# Altium schematic sheet MAZ000158 - Diagrama físico.SchDoc: MAZ000158 - Diagrama físico
size A; ApprovedBy: Christian Ledwidth; CheckedBy: Nahuel Martinez; Author: Santiago Marti; CompanyName: Body Health; DrawnBy: Santiago Marti; Revision: A; SheetNumber: 2; SheetTotal: 2
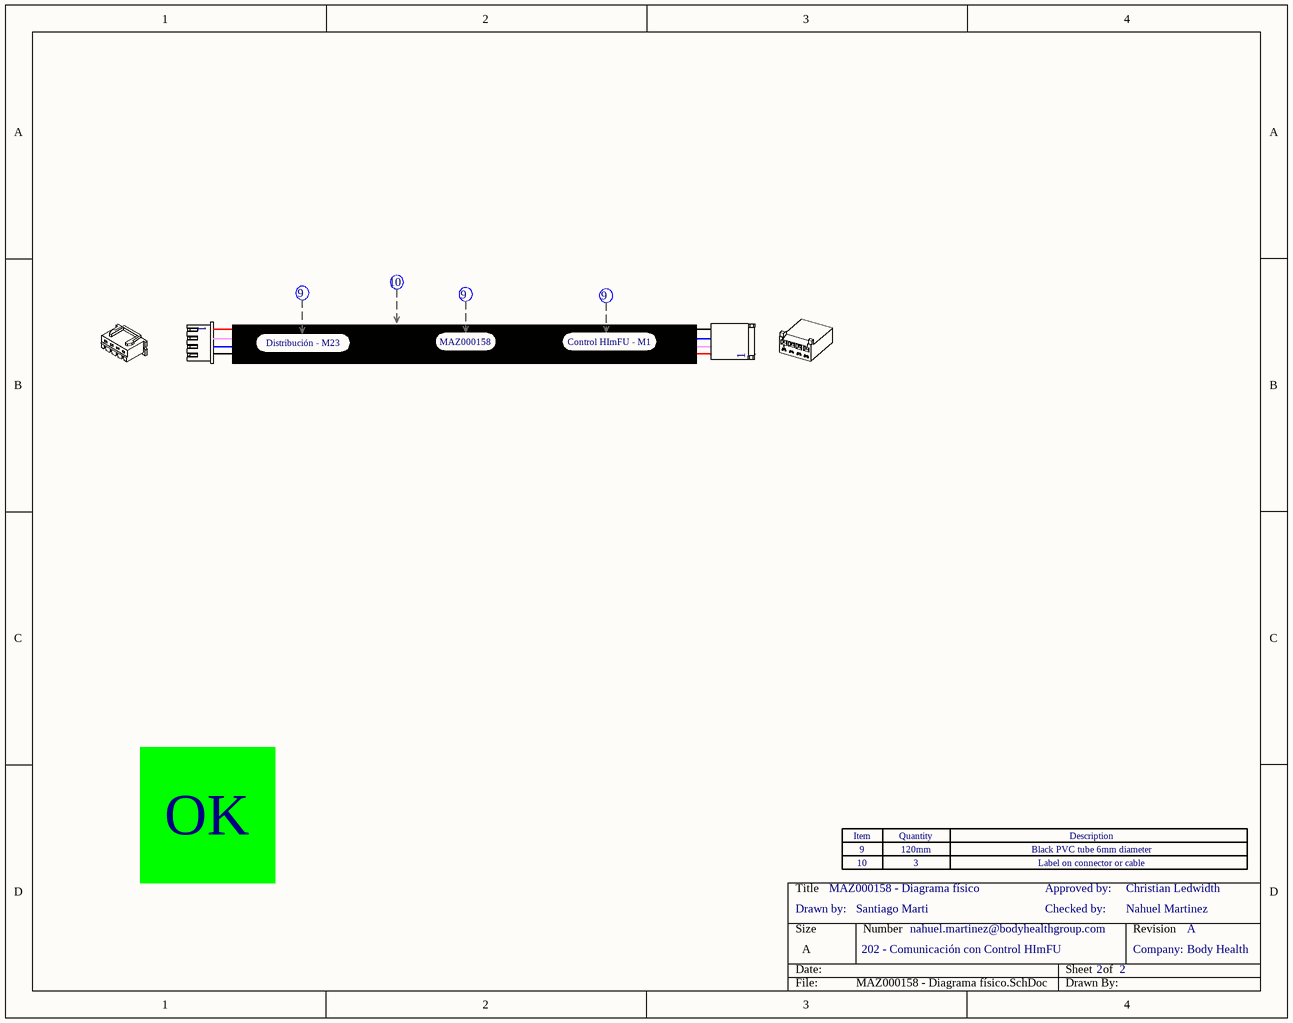
[diagram p0: MAZ000158 - Diagrama físico.SchDoc]

## Parts
Con1  XHP-4  (value not drawn)  (parts A,B of 4)
Con2  CST-100-4  (value not drawn)  (parts A,B of 4)
Eti1  Etiqueta  (value not drawn)
Eti2  Etiqueta  (value not drawn)
Eti3  Etiqueta  (value not drawn)
Ter1  Termocontraible  (value not drawn)
Zoc1  Zócalo_Header  (value not drawn)
Zoc10  Zócalo_Item  (value not drawn)
Zoc11  Zócalo_Item  (value not drawn)

## Notes on the sheet
- Distribución - M23
- (near Eti2) MAZ000158
- (near Eti3) Control HImFU - M1
- OK
- Drawn by:
- 10
- 9
- 3
- 120mm
- Checked by:
- Approved by:
- Label on connector or cable
- Black PVC tube 6mm diameter
- 202 - Comunicación con Control HImFU
- nahuel.martinez@bodyhealthgroup.com
- Company:
- (in symbol Zócalo_Header) Item; Quantity; Description

## Library data of the parts
Con1 = XHP-4: CONN HOUSING 2.5MM 4POS; Fabricante: JST Sales America Inc.; Cod.DigiKey: 455-2267-ND; Cod.Fabricante: XHP-4; ComponentLink1Description: Manufacturer Link; ComponentLink1URL: http://www.jst-mfg.com/product/pdf/eng/eXH.pdf; DIGIKEYx50: 0.06220; CallOut: *; DIGIKEYx100: NO
Con2 = CST-100-4: CONN RCPT HSNG 4POS CST-100 II; Cod.Fabricante: 1375820-4; Fabricante: TE Connectivity AMP Connectors; Cod.DigiKey: A99615-ND; ComponentLink1Description: Manufacturer Link; ComponentLink1URL: https://www.te.com/commerce/DocumentDelivery/DDEController?Action=srchrtrv&DocNm=1375820&DocType=Customer+Drawing&DocLang=English; DIGIKEYx50: 0.18440; CallOut: *; DIGIKEYx100: 0.17120
Eti1-Eti3 = Etiqueta: CallOut: 9; Texto: *
Ter1 = Termocontraible: CallOut: 10; Largo: *; Diámetro: *
Zoc1 = Zócalo_Header: Header para el zócalo de referencias
Zoc10 Zoc11 = Zócalo_Item: Ítem para el zócalo de referencias; Desginator: *; Quantity: *; ItemDescription: *